# EAGLE design P2H-001 (EAGLE 7.1.0)
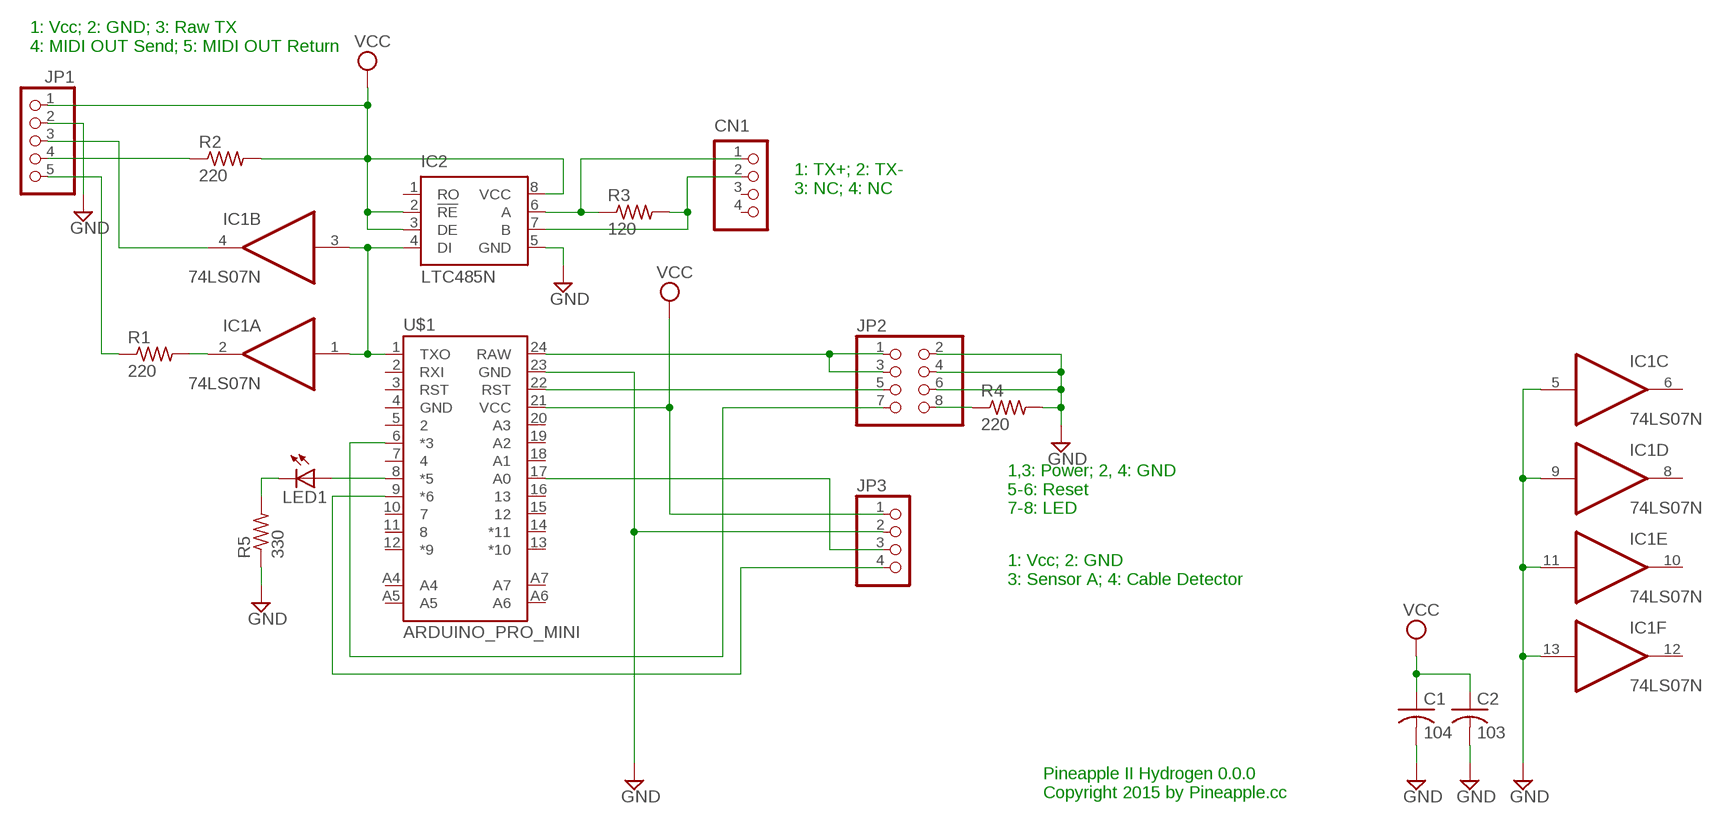
[diagram p0: schematic, sheet 1]

## Parts
C1  104  C-US025-025X050  [C025-025X050]
C2  103  C-US025-025X050  [C025-025X050]
CN1  B4B-PH-K-S  [B4B-PH-K-S]
IC1  74LS07N  [DIL14]
IC2  LTC485N  [DIL08]
JP1  PINHD-1X5  [1X05]
JP2  PINHD-2X4  [2X04]
JP3  PINHD-1X4  [1X04]
LED1  LED3MM  [LED3MM]
R1  220  R-US_0204/5  [0204/5]
R2  220  R-US_0204/5  [0204/5]
R3  120  R-US_0204/5  [0204/5]
R4  220  R-US_0204/5  [0204/5]
R5  330  R-US_0204/5  [0204/5]
U$1  ARDUINO_PRO_MINI  [ARDUINO_PRO_MINI]

## Nets
GND: C1.2 C2.2 IC1.5(C:I) IC1.9(D:I) IC1.11(E:I) IC1.13(F:I) IC2.5(GND) JP1.2 JP2.2 JP2.4 JP2.6 JP3.2 R4.2 R5.1 U$1.23(GND)
N$1: IC1.1(A:I) IC1.3(B:I) IC2.4(DI) U$1.1(TXO)
N$2: IC1.2(A:O) R1.2
N$3: JP1.4 R2.1
N$4: IC1.4(B:O) JP1.3
N$5: JP2.8 R4.1
N$6: JP2.5 U$1.22(RST)
N$7: JP1.5 R1.1
N$8: JP2.7 U$1.6(*3)
N$9: JP2.1 JP2.3 U$1.24(RAW)
N$10: JP3.3 U$1.17(A0)
N$11: JP3.4 U$1.9(*6)
N$12: LED1.A U$1.8(*5)
N$13: LED1.K(C) R5.2
N$18: CN1.1 IC2.6(A) R3.1
N$19: CN1.2 IC2.7(B) R3.2
VCC: C1.1 C2.1 IC2.2(!RE) IC2.3(DE) IC2.8(VCC) JP1.1 JP3.1 R2.2 U$1.21(VCC)
Unconnected: CN1.3 CN1.4 IC1.6(C:O) IC1.8(D:O) IC1.10(E:O) IC1.12(F:O) IC2.1(RO) U$1.2(RXI) U$1.3(RST) U$1.4(GND) U$1.5 U$1.7 U$1.10 U$1.11 U$1.12(*9) U$1.13(*10) U$1.14(*11) U$1.15 U$1.16 U$1.18(A1) U$1.19(A2) U$1.20(A3) U$1.A4 U$1.A5 U$1.A6 U$1.A7

## Notes on the sheet
- 1: Vcc; 2: GND; 3: Raw TX
  4: MIDI OUT Send; 5: MIDI OUT Return
- 1: TX+; 2: TX-
  3: NC; 4: NC
- 1,3: Power; 2, 4: GND
  5-6: Reset
  7-8: LED
- 1: Vcc; 2: GND
  3: Sensor A; 4: Cable Detector
- Pineapple II Hydrogen 0.0.0
  Copyright 2015 by Pineapple.cc

## Power pins joined to a net without a drawn wire
GND: IC1.7(P:GND)
VCC: IC1.14(P:VCC)

## Library data of the parts
C1 C2 = rcl:C-US: CAPACITOR, American symbol
CN1 = jst-ph:B4B-PH-*: Wire-to-Board 2.0mm pitch top mount connector Source: http://www.jst-mfg.com/product/pdf/jpn/PH.pdf http://www.jst-mfg.com/product/detail.php?series=199
IC1 = 74xx-us:74*07: Hex BUFFER, open collector high-voltage output
IC2 = linear-technology:LTC485: Low Power RS485 Interface Transceiver Source: http://www.linear.com/pc/downloadDocument.do?navId=H0,C1,C1007,C1017,P2064,D1718; OC_FARNELL: unknown; OC_NEWARK: unknown
JP1 = pinhead:PINHD-1X5: PIN HEADER
JP2 = pinhead:PINHD-2X4: PIN HEADER
JP3 = pinhead:PINHD-1X4: PIN HEADER
LED1 = led:LED: LED OSRAM: - CHIPLED LG R971, LG N971, LY N971, LG Q971, LY Q971, LO R971, LY R971 LH N974, LH R974 LS Q976, LO Q976, LY Q976 LO Q996 - Hyper CHIPLED LW Q18S LB Q993, LB Q99A, LB R99A - SideLED LS A670, LO A670, LY A670, LG A670, LP A670 LB A673, LV A673, LT A673, LW A673 LH A674 LY A675 LS A676, LA A676, LO A676, LY A676, LW A676 LS A679, LY A679, LG A679 - Hyper Micro SIDELED® LS Y876, LA Y876, LO Y876, LY Y876 LT Y87S - SmartLED LW L88C, LW L88S LB L89C, LB L89S, LG L890 LS L89K, LO L89K, LY L89K LS L896, LA L896, LO L896, LY L896 - TOPLED LS T670, LO T670, LY T670, LG T670, LP T670 LSG T670, LSP T670, LSY T670, LOP T670, LYG T670 LG T671, LOG T671, LSG T671 LB T673, LV T673, LT T673, LW T673 LH T674 LS T676, LA T676, LO T676, LY T676, LB T676, LH T676, LSB T676, LW T676 LB T67C, LV T67C, LT T67C, LS T67K, LO T67K, LY T67K, LW E67C LS E67B, LA E67B, LO E67B, LY E67B, LB E67C, LV E67C, LT E67C LW T67C LS T679, LY T679, LG T679 LS T770, LO T770, LY T770, LG T770, LP T770 LB T773, LV T773, LT T773, LW T773 LH T774 LS E675, LA E675, LY E675, LS T675 LS T776, LA T776, LO T776, LY T776, LB T776 LHGB T686 LT T68C, LB T68C - Hyper Mini TOPLED® LB M676 - Mini TOPLED Santana® LG M470 LS M47K, LO M47K, LY M47K Source: http://www.osram.convergy.de LUXEON: - LUMILED® LXK2-PW12-R00, LXK2-PW12-S00, LXK2-PW14-U00, LXK2-PW14-V00 LXK2-PM12-R00, LXK2-PM12-S00, LXK2-PM14-U00 LXK2-PE12-Q00, LXK2-PE12-R00, LXK2-PE12-S00, LXK2-PE14-T00, LXK2-PE14-U00 LXK2-PB12-K00, LXK2-PB12-L00, LXK2-PB12-M00, LXK2-PB14-N00, LXK2-PB14-P00, LXK2-PB14-Q00 LXK2-PR12-L00, LXK2-PR12-M00, LXK2-PR14-Q00, LXK2-PR14-R00 LXK2-PD12-Q00, LXK2-PD12-R00, LXK2-PD12-S00 LXK2-PH12-R00, LXK2-PH12-S00 LXK2-PL12-P00, LXK2-PL12-Q00, LXK2-PL12-R00 Source: www.luxeon.com KINGBRIGHT: KA-3528ASYC Source: www.kingbright.com
R1-R5 = resistor:R-US_: RESISTOR, American symbol
U$1 = SparkFun-Boards:ARDUINO_PRO_MINI

## Board
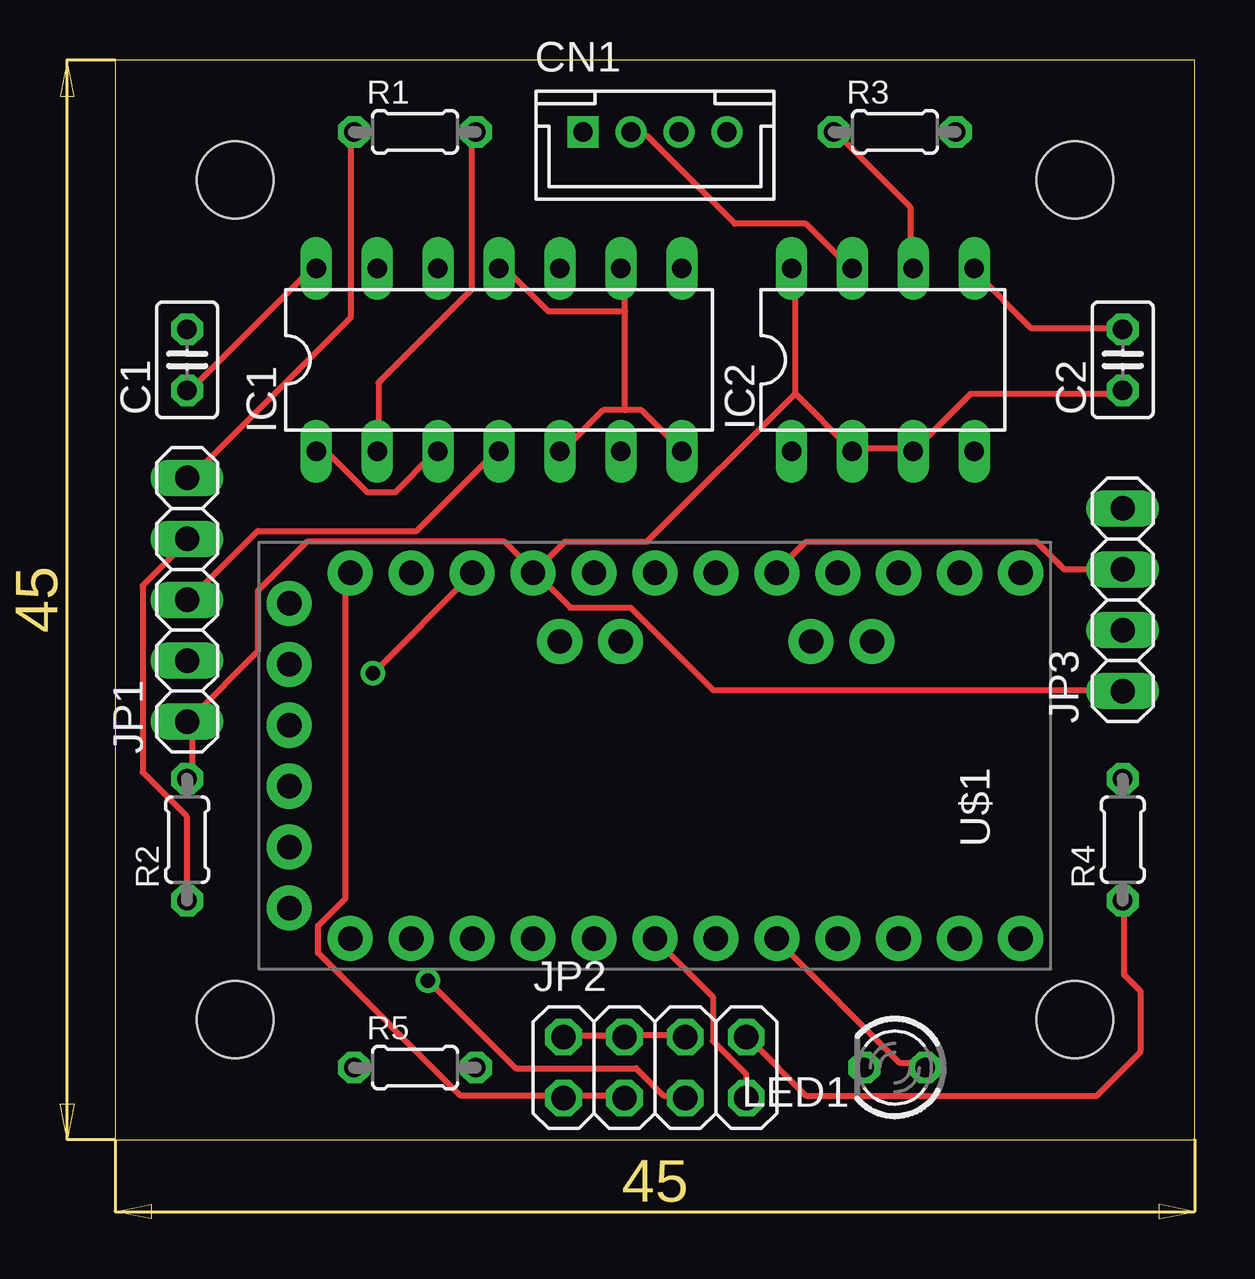
[diagram p1: board, top side]
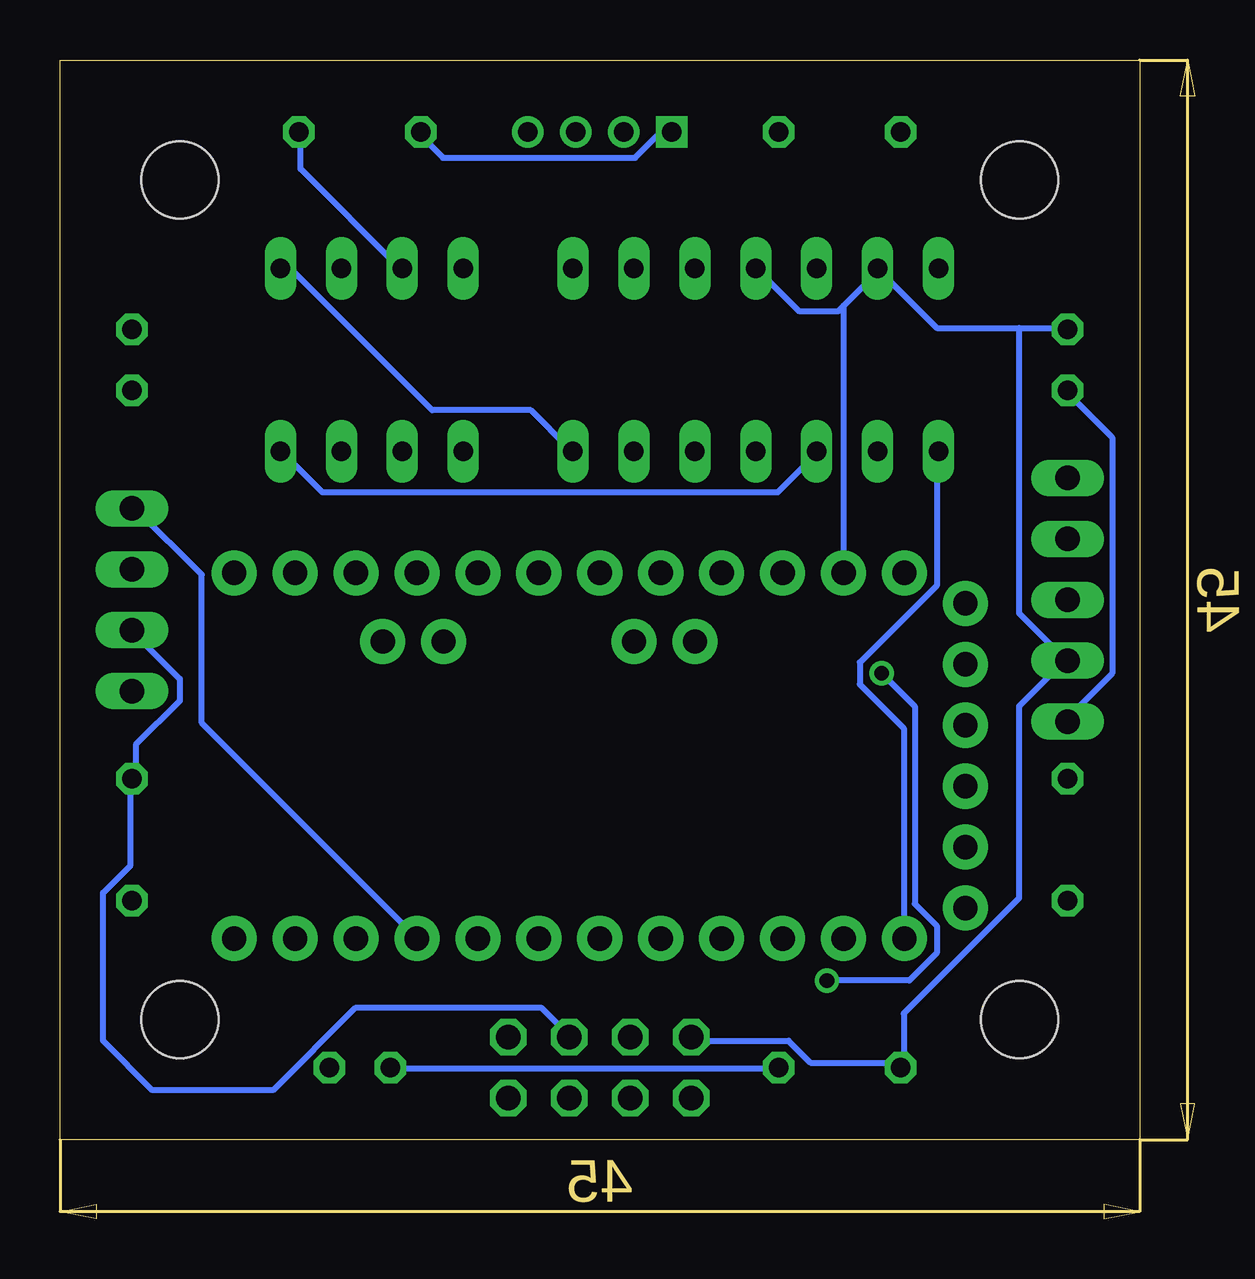
[diagram p2: board, bottom side, seen from below]

Size 45 x 45 mm. Coordinates in mm from the lower left corner, seen from the top.
Outline: 0,0 45,0 45,45 0,45 0,0
Copper layers (1*16): Top 0.035mm / dielectric 1.5mm / Bottom 0.035mm
Design rules "default": minimum track width 10mil, minimum drill 24mil, track to track 8mil, track to pad 8mil, pad to pad 8mil, via to via 8mil, smd to smd 8mil, copper to edge 40mil, drill to drill 8mil, minimum pad ring 10mil, minimum via ring 8mil, stop-mask expansion 4mil, vias tented up to drill 0mil, thermal gap 10mil
Holes 3.2 mm at 5,5 5,40 40,5 40,40

### Footprints (pad centres in the part's own frame; a part is rotated, then mirrored left to right if it is on the bottom)
C025-025X050 = drill 0.813 octagon: 1 -1.27,0; 2 1.27,0
B4B-PH-K-S = drill 0.8 square: 1 -3,0 | drill 0.8: 2 -1,0; 3 1,0; 4 3,0
DIL14 = drill 0.813 long: 1 -7.62,-3.81; 2 -5.08,-3.81; 3 -2.54,-3.81; 4 0,-3.81; 5 2.54,-3.81; 6 5.08,-3.81; 7 7.62,-3.81; 8 7.62,3.81; 9 5.08,3.81; 10 2.54,3.81; 11 0,3.81; 12 -2.54,3.81; 13 -5.08,3.81; 14 -7.62,3.81
DIL08 = drill 0.813 long: 1 -3.81,-3.81; 2 -1.27,-3.81; 3 1.27,-3.81; 4 3.81,-3.81; 5 3.81,3.81; 6 1.27,3.81; 7 -1.27,3.81; 8 -3.81,3.81
1X05 = drill 1.016 long: 1 -5.08,0; 2 -2.54,0; 3 0,0; 4 2.54,0; 5 5.08,0
2X04 = drill 1.016 octagon: 1 -3.81,-1.27; 2 -3.81,1.27; 3 -1.27,-1.27; 4 -1.27,1.27; 5 1.27,-1.27; 6 1.27,1.27; 7 3.81,-1.27; 8 3.81,1.27
1X04 = drill 1.016 long: 1 -3.81,0; 2 -1.27,0; 3 1.27,0; 4 3.81,0
LED3MM = drill 0.813 octagon: A -1.27,0; K 1.27,0
0204/5 = drill 0.813 octagon: 1 -2.54,0; 2 2.54,0
ARDUINO_PRO_MINI = drill 1.016 pad 1.88: 1 -7.62,12.7; 2 -7.62,10.16; 3 -7.62,7.62; 4 -7.62,5.08; 5 -7.62,2.54; 6 -7.62,0; 7 -7.62,-2.54; 8 -7.62,-5.08; 9 -7.62,-7.62; 10 -7.62,-10.16; 11 -7.62,-12.7; 12 -7.62,-15.24; 13 7.62,-15.24; 14 7.62,-12.7; 15 7.62,-10.16; 16 7.62,-7.62; 17 7.62,-5.08; 18 7.62,-2.54; 19 7.62,0; 20 7.62,2.54; 21 7.62,5.08; 22 7.62,7.62; 23 7.62,10.16; 24 7.62,12.7; A4 4.763,1.429; A5 4.763,3.969; A6 4.763,-9.049; A7 4.763,-6.509; BLK -6.35,15.24; GND -3.81,15.24; GRN 6.35,15.24; RXI 1.27,15.24; TXO 3.81,15.24; VCC -1.27,15.24

### Placement (x,y rotation side)
C1  3,32.5 90 top
C2  42,32.5 90 top
CN1  22.5,42 0 top
IC1  16,32.5 0 top
IC2  32,32.5 0 top
JP1  3,22.5 90 top
JP2  22.5,3 0 top
JP3  42,22.5 90 top
LED1  32.5,3 180 top
R1  12.5,42 0 top
R2  3,12.5 90 top
R3  32.5,42 0 top
R4  42,12.5 90 top
R5  12.5,3 0 top
U$1  22.5,16 90 top

### Tracks (layer width: path | path; a pad name or v marks a point on that pad's centre or on a via)
GND
  Top 0.254: JP2.6 23.55,4.34 21.26,4.34 JP2.4 21.03,4.34 18.75,4.34 JP2.2 | C2.2 41.83,33.83 38.18,33.83 35.89,36.12 IC2.5 | 21.26,30.4 21.95,30.4 23.55,28.8 IC1.7 | 21.26,30.4 20.34,30.4 18.75,28.8 IC1.5 | 21.26,30.4 21.26,34.52 | 21.26,34.52 21.26,36.12 IC1.9 | 21.26,34.52 18.06,34.52 16.46,36.12 16,36.12 IC1.11
  Bottom 0.254: JP3.2 41.83,21.03 40.01,19.2 40.01,18.29 41.83,16.46 41.83,15.09 R4.2 42.06,14.86 42.06,11.43 43.2,10.29 43.2,4.12 41.15,2.06 36.12,2.06 32.69,5.49 24.92,5.49 23.77,4.34 JP2.6 | JP2.2 18.52,4.12 14.63,4.12 13.72,3.2 10.06,3.2 R5.1 9.83,3.2 9.83,5.26 5.03,10.06 5.03,18.06 3.2,19.89 JP1.2 3.2,20.12 5.03,21.95 5.03,33.83 | 5.03,33.83 8.46,33.83 10.74,36.12 IC1.13 10.97,36.12 12.34,34.75 | 5.03,33.83 3.2,33.83 C1.2 | 12.34,34.75 12.57,34.52 14.17,34.52 15.77,36.12 IC1.11 | 12.34,34.75 12.34,23.77 U$1.23 | IC2.5 35.66,36.12 35.2,36.12 29.49,30.4 25.38,30.4 23.77,28.8 IC1.7
N$1
  Top 0.254: IC1.1 8.46,28.57 8.91,28.57 10.52,26.98 11.66,26.98 13.26,28.57 IC1.3
  Bottom 0.254: IC2.4 35.66,28.57 34.06,26.98 15.09,26.98 13.49,28.57 IC1.3 | U$1.1 9.83,8.46 9.83,17.14 11.66,18.97 11.66,19.89 8.46,23.09 8.46,28.57 IC1.1
N$2
  Top 0.254: IC1.2 10.97,28.8 10.97,31.55 14.86,35.43 14.86,41.83 R1.2
N$3
  Top 0.254: R2.1 2.97,10.06 2.97,13.49 1.14,15.32 1.14,23.09 2.97,24.92 JP1.4
N$4
  Top 0.254: IC1.4 15.77,28.57 12.57,25.38 5.94,25.38 3.2,22.63 JP1.3
N$5
  Top 0.254: R4.1 42.06,9.83 42.06,6.86 42.75,6.17 42.75,3.66 40.92,1.83 28.8,1.83 26.52,4.12 JP2.8
N$6  (via drill 0.61)
  Top 0.254: v13.03,6.63 16.69,2.97 21.72,2.97 22.86,1.83 23.55,1.83 JP2.5 | v10.74,19.43 14.86,23.55 U$1.22
  Bottom 0.254: v13.03,6.63 9.6,6.63 8.46,7.77 8.46,8.91 9.37,9.83 9.37,18.06 v10.74,19.43
N$7
  Top 0.254: R1.1 9.83,41.83 9.83,34.29 3.2,27.66 JP1.5
N$8
  Top 0.254: JP2.7 26.29,1.83 26.29,2.74 24.92,4.12 24.92,5.94 22.63,8.23 U$1.6
N$9
  Top 0.254: JP2.3 21.03,1.83 18.75,1.83 JP2.1 18.52,1.83 14.4,1.83 8.46,7.77 8.46,8.91 9.6,10.06 9.6,23.55 U$1.24
N$10
  Top 0.254: JP3.3 41.83,23.77 39.55,23.77 38.41,24.92 28.8,24.92 27.66,23.77 U$1.17
N$11
  Bottom 0.254: JP3.4 41.83,26.29 39.09,23.55 39.09,17.37 30.18,8.46 U$1.9
N$12
  Top 0.254: LED1.A 33.6,3.2 32.69,3.2 27.66,8.23 U$1.8
N$13
  Bottom 0.254: R5.2 15.09,2.97 31.09,2.97 LED1.K
N$18
  Top 0.254: IC2.6 33.15,36.35 33.15,38.86 30.18,41.83 R3.1
  Bottom 0.254: CN1.1 19.66,41.83 20.12,41.83 21.03,40.92 29.03,40.92 29.95,41.83 R3.1
N$19
  Top 0.254: CN1.2 21.72,41.83 22.17,41.83 25.83,38.18 28.8,38.18 30.63,36.35 IC2.7
  Bottom 0.254: R3.2 34.98,41.83 34.98,40.46 30.86,36.35 IC2.7
VCC
  Top 0.254: R2.2 3.2,15.09 3.2,17.37 JP1.1 3.2,17.6 5.94,20.34 5.94,22.86 8,24.92 16.23,24.92 17.37,23.77 U$1.21 | C1.1 3.2,31.32 8.23,36.35 IC1.14 | 28.35,31.09 28.35,36.12 IC2.8 | 28.35,31.09 30.63,28.8 IC2.2 30.86,28.8 33.15,28.8 IC2.3 33.38,28.8 35.66,31.09 41.83,31.09 C2.1 | JP3.1 41.83,18.75 24.92,18.75 21.49,22.17 18.97,22.17 17.6,23.55 U$1.21 | 28.35,31.09 22.17,24.92 18.75,24.92 17.6,23.77 U$1.21
  Bottom 0.254: JP1.1 2.97,17.6 1.14,19.43 1.14,29.26 2.97,31.09 C1.1